# Altium schematic sheet EEE314 PIC32540 Programmer.SchDoc
size 558 x 431 mm; SheetNumber: 1; SheetTotal: 1
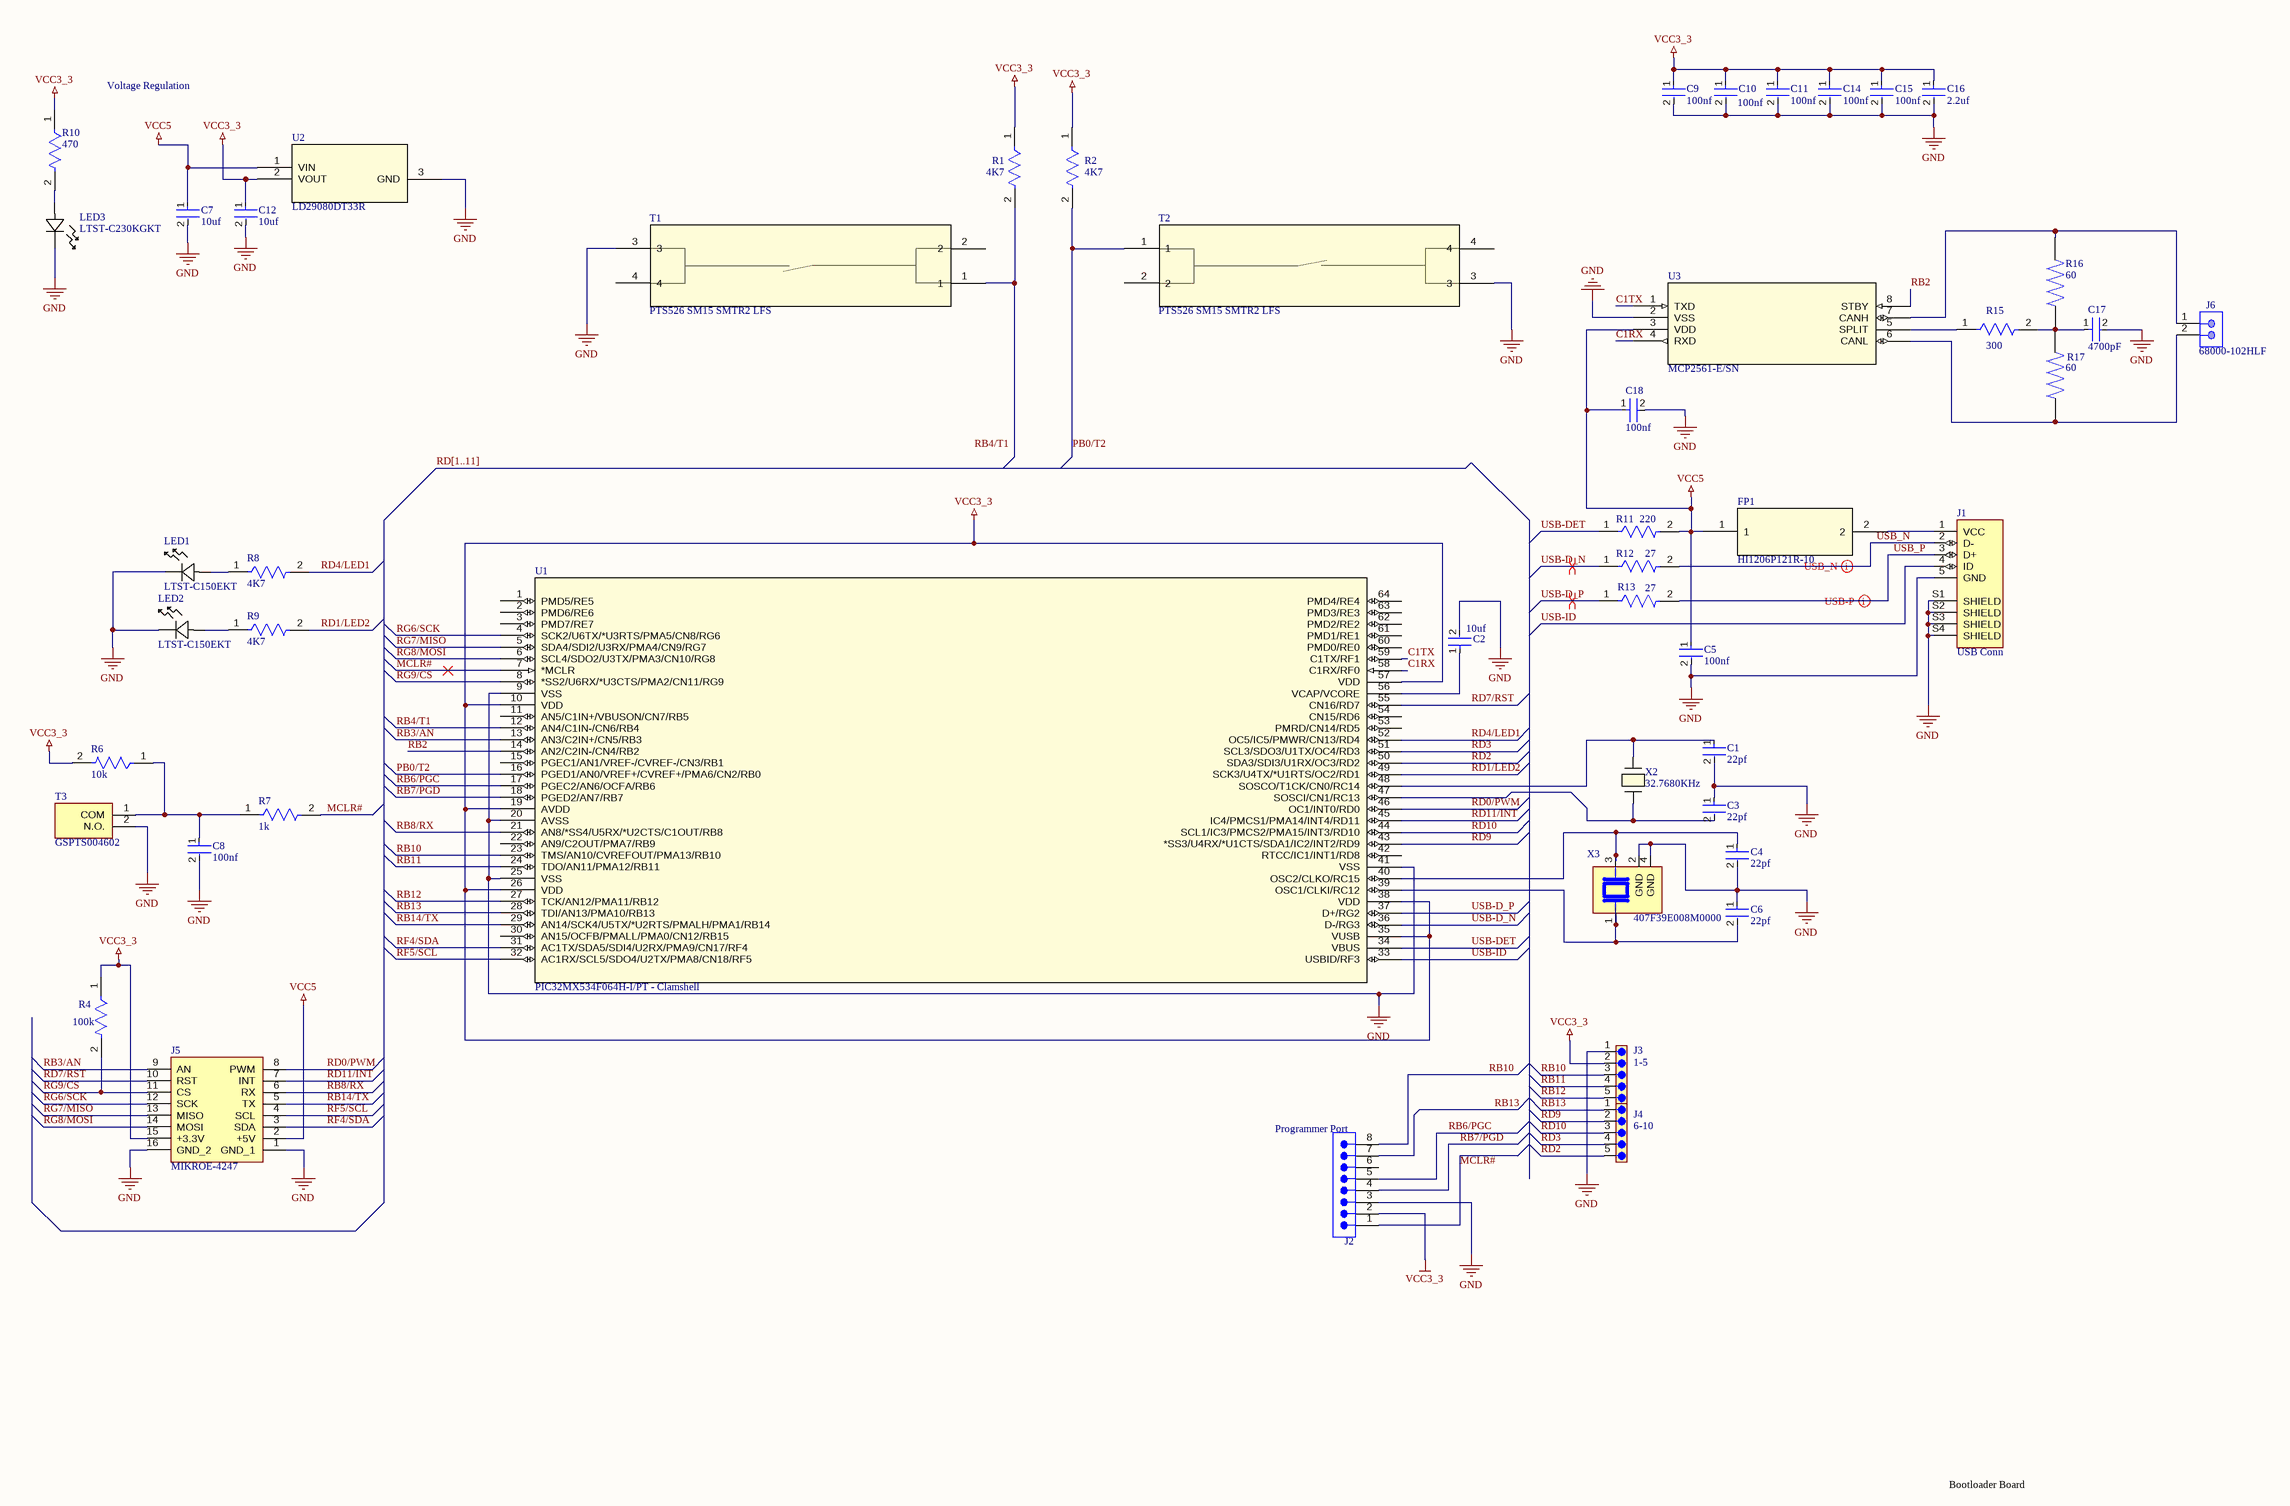
[diagram p0: EEE314 PIC32540 Programmer.SchDoc]

## Parts
C1  22pf  [FP-1206-L_3_2_0_2-W_1_6_0-IPC_A]
C2  10uf  [FP-1206-L_3_2_0_2-W_1_6_0-IPC_A]
C3  22pf  [FP-1206-L_3_2_0_2-W_1_6_0-IPC_A]
C4  22pf  [FP-1206-L_3_2_0_2-W_1_6_0-IPC_A]
C5  100nf  [FP-1206-L_3_2_0_2-W_1_6_0-IPC_A]
C6  22pf  [FP-1206-L_3_2_0_2-W_1_6_0-IPC_A]
C7  10uf  [FP-1206-L_3_2_0_2-W_1_6_0-IPC_A]
C8  100nf  [FP-1206-L_3_2_0_2-W_1_6_0-IPC_A]
C9  100nf  [FP-1206-L_3_2_0_2-W_1_6_0-IPC_A]
C10  100nf  [FP-1206-L_3_2_0_2-W_1_6_0-IPC_A]
C11  100nf  [FP-1206-L_3_2_0_2-W_1_6_0-IPC_A]
C12  10uf  [FP-1206-L_3_2_0_2-W_1_6_0-IPC_A]
C14  100nf  [FP-1206-L_3_2_0_2-W_1_6_0-IPC_A]
C15  100nf  [FP-1206-L_3_2_0_2-W_1_6_0-IPC_A]
C16  2.2uf  [FP-1206-L_3_2_0_2-W_1_6_0-IPC_A]
C17  4700pF  [FP-1206-L_3_2_0_2-W_1_6_0-IPC_A]
C18  100nf  [FP-1206-L_3_2_0_2-W_1_6_0-IPC_A]
FP1  HI1206P121R-10  [HI1206P121R-10_LRD]
J1  USB Conn  [AMPHENOL_10033526-N3212MLF]
J2  Programmer Port  [61300811021]
J3  1-5  [61300511121]
J4  6-10  [61300511121]
J5  MIKROE-4247  [MIKROE4247]
J6  68000-102HLF  [AMPH-68000-102HLF_V]
LED1  LTST-C150EKT  [test led]
LED2  LTST-C150EKT  [test led]
LED3  LTST-C230KGKT  [LED_LTST-C230KGKT_LTO]
R1  4K7  [FP-RMCF1206-IPC_A]
R2  4K7  [FP-RMCF1206-IPC_A]
R4  100k  [FP-RMCF1206-IPC_A]
R6  10k  [FP-RMCF1206-IPC_A]
R7  1k  [FP-RMCF1206-IPC_A]
R8  4K7  [FP-RMCF1206-IPC_A]
R9  4K7  [FP-RMCF1206-IPC_A]
R10  470  [FP-RMCF1206-IPC_A]
R11  220  [FP-RMCF1206-IPC_A]
R12  27  [FP-RMCF1206-IPC_A]
R13  27  [FP-RMCF1206-IPC_A]
R15  300  [FP-RMCF1206-IPC_B]
R16  60  [RESC3116X60N]
R17  60  [RESC3116X60N]
T1  PTS526 SM15 SMTR2 LFS  [SON4_PTS526 SM15 SMTR2 LFS_CNK]
T2  PTS526 SM15 SMTR2 LFS  [SON4_PTS526 SM15 SMTR2 LFS_CNK]
T3  GSPTS004602  [GSPTS004602]
U1  PIC32MX534F064H-I/PT - Clamshell  [MCU_64BIT_CLAMSHELL_2x16_2ROWS_1900MILFAR]
U2  LD29080DT33R  [DPAK_STM]
U3  MCP2561-E/SN  [SOIC8-N_MC_MCH]
X2  32.7680KHz  [XTAL_FC-135_EPS]
X3  407F39E008M0000  [XTAL_407F39E008M0000]

## Nets
GND: C1.2 C2.2 C3.1 C4.2 C5.2 C6.1 C7.2 C8.2 C9.2 C10.2 C11.2 C12.2 C14.2 C15.2 C16.2 C17.2 C18.2 J1.5(GND) J1.S1(SHIELD) J1.S2(SHIELD) J1.S3(SHIELD) J1.S4(SHIELD) J2.3 J3.1 J5.1(GND_1) J5.16(GND_2) LED1.1 LED2.1 LED3.1 T1.3 T2.3 T3.2(N.O.) U1.9(VSS) U1.20(AVSS) U1.25(VSS) U1.41(VSS) U2.3(GND) U3.2(VSS) X3.2(GND) X3.4(GND)
VCC3_3: C9.1 C10.1 C11.1 C12.1 C14.1 C15.1 C16.1 J2.2 J3.2 J5.15(+3.3V) R1.1 R2.1 R4.1 R6.2 R10.1 U1.10(VDD) U1.19(AVDD) U1.26(VDD) U1.35(VUSB) U1.38(VDD) U1.57(VDD) U2.2(VOUT)
VCC5: C5.1 C7.1 C18.1 FP1.1 J5.2(+5V) R11.2 U2.1(VIN) U3.3(VDD)
C1RX: U1.58(C1RX/RF0) U3.4(RXD)
C1TX: U1.59(C1TX/RF1) U3.1(TXD)
MCLR#: J2.1 R7.2 U1.7(*MCLR)
PB0/T2: R2.2 T2.1 U1.16(PGED1/AN0/VREF+/CVREF+/PMA6/CN2/RB0)
RB2: U1.14(AN2/C2IN-/CN4/RB2) U3.8(STBY)
RB3/AN: J5.9(AN) U1.13(AN3/C2IN+/CN5/RB3)
RB4/T1: U1.12(AN4/C1IN-/CN6/RB4)
RB6/PGC: J2.5 U1.17(PGEC2/AN6/OCFA/RB6)
RB7/PGD: J2.4 U1.18(PGED2/AN7/RB7)
RB8/RX: J5.6(RX) U1.21(AN8/*SS4/U5RX/*U2CTS/C1OUT/RB8)
RB10: J2.8 J3.3 U1.23(TMS/AN10/CVREFOUT/PMA13/RB10)
RB11: J3.4 U1.24(TDO/AN11/PMA12/RB11)
RB12: J3.5 U1.27(TCK/AN12/PMA11/RB12)
RB13: J2.7 J4.1 U1.28(TDI/AN13/PMA10/RB13)
RB14/TX: J5.5(TX) U1.29(AN14/SCK4/U5TX/*U2RTS/PMALH/PMA1/RB14)
RD0/PWM: J5.8(PWM) U1.46(OC1/INT0/RD0)
RD1/LED2: R9.2 U1.49(SCK3/U4TX/*U1RTS/OC2/RD1)
RD2: J4.5 U1.50(SDA3/SDI3/U1RX/OC3/RD2)
RD3: J4.4 U1.51(SCL3/SDO3/U1TX/OC4/RD3)
RD4/LED1: R8.2 U1.52(OC5/IC5/PMWR/CN13/RD4)
RD7/RST: J5.10(RST) U1.55(CN16/RD7)
RD9: J4.2 U1.43(*SS3/U4RX/*U1CTS/SDA1/IC2/INT2/RD9)
RD10: J4.3 U1.44(SCL1/IC3/PMCS2/PMA15/INT3/RD10)
RD11/INT: J5.7(INT) U1.45(IC4/PMCS1/PMA14/INT4/RD11)
RF4/SDA: J5.3(SDA) U1.31(AC1TX/SDA5/SDI4/U2RX/PMA9/CN17/RF4)
RF5/SCL: J5.4(SCL) U1.32(AC1RX/SCL5/SDO4/U2TX/PMA8/CN18/RF5)
RG6/SCK: J5.12(SCK) U1.4(SCK2/U6TX/*U3RTS/PMA5/CN8/RG6)
RG7/MISO: J5.13(MISO) U1.5(SDA4/SDI2/U3RX/PMA4/CN9/RG7)
RG8/MOSI: J5.14(MOSI) U1.6(SCL4/SDO2/U3TX/PMA3/CN10/RG8)
RG9/CS: J5.11(CS) R4.2 U1.8(*SS2/U6RX/*U3CTS/PMA2/CN11/RG9)
USB-D_N: R12.1 U1.36(D-/RG3)
USB-D_P: R13.1 U1.37(D+/RG2)
USB-DET: R11.1 U1.34(VBUS)
USB-ID: J1.4(ID) U1.33(USBID/RF3)
USB_N: J1.2(D-) R12.2
USB_P: J1.3(D+) R13.2
NetC1_1: C1.1 U1.48(SOSCO/T1CK/CN0/RC14) X2.2
NetC2_1: C2.1 U1.56(VCAP/VCORE)
NetC3_2: C3.2 U1.47(SOSCI/CN1/RC13) X2.1
NetC4_1: C4.1 U1.40(OSC2/CLKO/RC15) X3.3
NetC6_2: C6.2 U1.39(OSC1/CLKI/RC12) X3.1
NetC8_1: C8.1 R6.1 R7.1 T3.1(COM)
NetC17_1: C17.1 R15.2 R16.1 R17.2
NetFP1_2: FP1.2 J1.1(VCC)
NetJ6_1: J6.1 R16.2 U3.7(CANH)
NetJ6_2: J6.2 R17.1 U3.6(CANL)
NetLED1_2: LED1.2 R8.1
NetLED2_2: LED2.2 R9.1
NetLED3_2: LED3.2 R10.2
NetR1_2: R1.2 T1.1
NetR15_1: R15.1 U3.5(SPLIT)

Not connected (* = marked no-connect by the designer): J2 6; T1 2 4; T2 2 4; U1 1(PMD5/RE5) 2(PMD6/RE6) 3(PMD7/RE7) 11(AN5/C1IN+/VBUSON/CN7/RB5) 15(PGEC1/AN1/VREF-/CVREF-/CN3/RB1) 22(AN9/C2OUT/PMA7/RB9) 30(AN15/OCFB/PMALL/PMA0/CN12/RB15) 42(RTCC/IC1/INT1/RD8) 53(PMRD/CN14/RD5) 54(CN15/RD6) 60(PMD0/RE0) 61(PMD1/RE1) 62(PMD2/RE2) 63(PMD3/RE3) 64(PMD4/RE4)

## Buses and harness runs
bus RD[1..11]

## Layout directives
differential pair: USB-D_N, USB-D_P, USB_N, USB_P

## Notes on the sheet
- Voltage Regulation
- Bootloader Board
- Labels drawn without touching a wire or pin: RB4/T1
- DWG. NO.
- REV.
- SHT.
- REVISION
- DESCRIPTION
- DATE
- APPROVED
- THIS DOCUMENT AND THE DATA DISCLOSED HEREIN OR HEREWITH IS THE PROPERTY OF ALTIUM LIMITED AND MAY BE FREELY DISTRIBUTED IN WHOLE. NO RIGHTS ARE RESERVED OR EXPRESS OR IMPLIED WARANTEE GIVEN.
- ENG:
- DSN:
- APPROVALS
- PROJECT
- DOCUMENT REVISION:
- DESIGN ITEM:
- CHK:
- BOM:
- REFERENCE DOCUMENTS
- PROJECT REVISION:
- TITLE
- FAB DWG:
- PCB DWG:
- ASSY DWG:
- SCALE:
- SIZE
- C
- CAGE CODE
- FILE NAME
- DWG NO.
- SHEET
- OF
- REV

## Library data of the parts
C1-C12 C14-C18 = CMP-04427-012685-1: Automotive Ceramic Capacitor, 1206, 100nF, 10%, X7R, 15%, 200V; Voltage Rating (DC): 200V; Case/Package: 1206; Length: 3.2mm; Max Operating Temperature: 125°C; Termination: SMD/SMT; Width: 1.6mm; Lead Free: Lead Free; Package Quantity: 2000; Min Operating Temperature: -55°C; Capacitance: 100nF; Height: 1.52mm; Depth: 1.6mm; Dielectric: X7R; Case Code (Metric): 3216; Packaging: Tape and Reel; Case Code (Imperial): 1206; Tolerance: 10%
FP1 = HI1206P121R-10: Description; Manufacturer_Name: Laird; Copyright: Copyright (C) 2025 Ultra Librarian. All rights reserved.; Manufacturer_Part_Number: HI1206P121R-10; RefDes: RefDes; Type: Type
J1 = 10033526-N3212MLF: Right Angle Surface Mount Mount Female Type B USB Connector | Amphenol FCI (Amphenol CS) 10033526-N3212MLF; MF: Amphenol ICC; SnapEDA_Link: https://www.snapeda.com/parts/10033526-N3212MLF/Amphenol/view-part/?ref=snap; Package: None; Value: *; MP: 10033526-N3212MLF; Check_prices: https://www.snapeda.com/parts/10033526-N3212MLF/Amphenol/view-part/?ref=eda
J2 = CMP-1502-01075-4: THT Angled Pin Header WR-PHD, Pitch 2.54 mm, Single Row, 8 pins; Operating Supply Voltage: 250V; Number of Positions: 8; Contact Resistance: 20mΩ; Gender: Male; Current Rating: 3A; Pitch: 2.54mm; Connector Type: Male Pin; Lead Pitch: 2.54mm; Termination: Solder; Number of Rows: 1; Number of Pins: 8; Number of Contacts: 8; Contact Plating: Gold; Contact Mating Length: 5.9944mm; Color: Black; RoHS: Compliant; Contact Material: Copper; Packaging: Bulk; Mount: Through Hole
J3 J4 = 6130XX11121_61300511121: MF: {'manufacturer': u'W\xfcrth Elektronik'}; Package: None; Price: None; Value: *; MP: 61300511121; Availability: Unavailable
J5 = MIKROE-4247: Sockets & Adapters SOCKET mikroBUS 16 TH; Manufacturer_Name: Mikroe; Geometry.Height: 11.6mm; Manufacturer_Part_Number: MIKROE-4247; Mouser Part Number: 932-MIKROE-4247; Mouser Price/Stock: https://www.mouser.co.uk/ProductDetail/Mikroe/MIKROE-4247?qs=zW32dvEIR3v60RwxHCFyew%3D%3D; Arrow Part Number: *; Arrow Price/Stock: *; Datasheet Link: https://download.mikroe.com/documents/mikrobu_socket/SOCKET%20mikroBUS%2016%20TH.pdf
J6 = CMP-2000-05666-1: Male Header, Pitch 2.54 mm, 1 x 2 Position, Height 8.38 mm, Tail Length 2.41 mm, RoHS, Bulk; Number of Positions: 2; Insulation Resistance: 5000MOhms; Voltage Rating: 1.5kV; Mounting Angle: Vertical; Pitch: 2.54mm; Brand: FCI; Current Rating: 3A; Mating Post Length: 5.84mm; Operating Temperature Range: -65Cto+125C; Product Category: Headers&WireHousings; Datasheet URL: https://datasheet.ciiva.com/5149/68000-274228-5149165.pdf; Number of Positions / Contacts: 2; Contact Gender: Pin(Male); Packaging: Bulk; Mounting Technology: ThroughHole; Product Type: Headers; Housing Material: Thermoplastic; Contact Material: PhosphorBronze; Contact Plating: Gold/GTX; Package Description: Male Header, Pitch 2.54 mm, 1 x 2 Position, Height 8.38 mm, Tail Length 2.41 mm; Package Reference: 68000-102HLF; Type: Unshrouded; Factory Pack Quantity: 100; Termination Style: ThroughHole; RoHS: Details; Series: 68000; Mounting Style: ThroughHole; Flammability Rating: UL94V-0; Number of Rows: 1; Manufacturer: FCI; Termination Post Length: 2.41mm; Manufacturer URL: http://www.amphenol.com/; Datasheet Version: Rev. F, 04/2006
LED1 LED2 = test led: Description; Manufacturer_Name: LITE-ON; Manufacturer_Part_Number: LTST-C150GKT; Copyright: Copyright (C) 2025 Ultra Librarian. All rights reserved.
LED3 = LTST-C230KGKT: LED GREEN CLEAR CHIP SMD; Manufacturer_Name: LITE-ON; Copyright: Copyright (C) 2025 Ultra Librarian. All rights reserved.; Manufacturer_Part_Number: LTST-C230KGKT
R1 R2 R4 R6-R13 = CMP-26527-005426-1: 4.7kΩ ±5% 0.25W 1206 Thick Film Chip Resistor AEC-Q200 compliant; Max Power Dissipation: 250mW; Resistance: 4.7kR; Temperature Coefficient: 200ppm/°C; RoHS Compliant: Yes; Radiation Hardening: No; Resistor Type: Thick Film; Number of Terminations: 2; Mount: Surface Mount; Series: RMCF; Tolerance: 5%; Features: Automotive AEC-Q200; Width: 0.063inch; Case Code (Metric): 3216; Military Standard: Not; Packaging: Tape and Reel; Height: 0.028inch; Size Code: 1206; Lead Free: Lead Free; Max Operating Temperature: 155°C; Length: 3.2mm; Construction: Rectangular; Depth: 1.6mm; Case/Package: 1206; Contact Plating: Tin; Case Code (Imperial): 1206; Power Rating: 250mW; Min Operating Temperature: -55°C
R15 = CMP-26527-001830-1: 300Ω ±5% 0.25W 1206 Thick Film Chip Resistor AEC-Q200 compliant; Temperature Coefficient: 200ppm/°C; Resistance: 300R; Max Power Dissipation: 250mW; Packaging: Tape and Reel; Case Code (Metric): 3216; Resistor Type: Thick Film; Depth: 1.6mm; Contact Plating: Tin; Radiation Hardening: No; Max Operating Temperature: 155°C; Series: RMCF; Construction: Rectangular; Mount: Surface Mount; Width: 0.063inch; Tolerance: 5%; RoHS Compliant: Yes; Height: 0.028inch; Number of Terminations: 2; Case Code (Imperial): 1206; Features: Automotive AEC-Q200; Length: 3.2mm; Lead Free: Lead Free; Military Standard: Not; Min Operating Temperature: -55°C; Case/Package: 1206
R16 R17 = CRCW120660R0KNEAIF: 60 Ohms Â±10% 0.25W, 1/4W Chip Resistor 1206 (3216 Metric) Automotive AEC-Q200, Pulse Withstanding Thick Film; MF: Vishay Dale; SnapEDA_Link: https://www.snapeda.com/parts/CRCW120660R0KNEAIF/Vishay+Dale/view-part/?ref=snap; Package: 3116 Vishay; Value: *; MP: CRCW120660R0KNEAIF; Check_prices: https://www.snapeda.com/parts/CRCW120660R0KNEAIF/Vishay+Dale/view-part/?ref=eda
T1 T2 = PTS526 SM15 SMTR2 LFS: Description; Manufacturer_Name: C&K Components; Copyright: Copyright (C) 2026 Ultra Librarian. All rights reserved.; Manufacturer_Part_Number: PTS526 SM15 SMTR2 LFS; RefDes: RefDes; Type: Type
T3 = GSPTS004602_1: Tactile Switch SPST-NO Top Actuated Surface Mount 0.05A,12VDC ,-40C ~ 90C,"PTS636SK25FSMTR LFS"; Manufacturer_Name: C & K COMPONENTS; Geometry.Height: 2.7mm; TTI Part Number: *; TTI Price/Stock: *; Manufacturer_Part_Number: GSPTS004602; Datasheet Link: https://www.ckswitches.com/media/2779/pts636.pdf
U1 = PIC32MX534F064H-IPT: Description; Manufacturer_Name: Microchip; Copyright: Copyright (C) 2025 Ultra Librarian. All rights reserved.; Manufacturer_Part_Number: PIC32MX534F064H-I/PT; RefDes: RefDes; Type: Type
U2 = LD29080DT33R: 800 mA fixed and adjustable output very low drop voltage regulator; Manufacturer_Name: STMicroelectronics; Copyright: Copyright (C) 2025 Ultra Librarian. All rights reserved.; Manufacturer_Part_Number: LD29080DT33R; RefDes: RefDes; Type: Type
U3 = MCP2561-ESN: Description; Manufacturer_Name: Microchip; Copyright: Copyright (C) 2025 Ultra Librarian. All rights reserved.; Manufacturer_Part_Number: MCP2561-E/SN; RefDes: RefDes; Type: Type
X2 = FC-135 32.7680KA-A5: Description; Manufacturer_Name: Epson; Copyright: Copyright (C) 2025 Ultra Librarian. All rights reserved.; Manufacturer_Part_Number: FC-135 32.7680KA-A5
X3 = CMP-003-00030-1: 8 MHz Â±30ppm Crystal 20pF 60 Ohms 4-SMD, No Lead; MF: CTS-Frequency Controls; Case/Package: NON STANDARD-4 CTS Components; Component Type: Standard; Check_prices: https://www.snapeda.com/parts/407F39E008M0000/CTS-Frequency+Controls/view-part/?ref=eda; MP: 407F39E008M0000; Value: *; SnapEDA_Link: https://www.snapeda.com/parts/407F39E008M0000/CTS-Frequency+Controls/view-part/?ref=snap; Design Item ID: 407F39E008M0000; Pins: 4; Source: 407F39E008M0000.SchLib